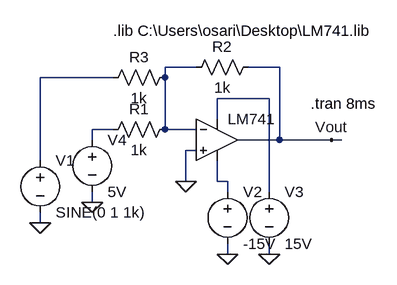
[diagram p0: schematic devre2.asc]
devre2.asc, the LTspice schematic file:
Version 4
SHEET 1 880 680
WIRE 96 96 48 96
WIRE 224 96 176 96
WIRE -32 112 -144 112
WIRE 48 112 48 96
WIRE 208 144 128 144
WIRE 128 176 128 144
WIRE -32 192 -64 192
WIRE 48 192 48 112
WIRE 96 192 48 192
WIRE -64 208 -64 192
WIRE 224 208 224 96
WIRE 224 208 160 208
WIRE 304 208 224 208
WIRE 320 208 304 208
WIRE 96 224 80 224
WIRE -144 240 -144 112
WIRE 80 272 80 224
WIRE 128 272 128 240
WIRE 144 272 128 272
WIRE 144 288 144 272
WIRE 208 288 208 144
WIRE -64 304 -64 288
WIRE -144 336 -144 320
WIRE 144 384 144 368
WIRE 208 384 208 368
FLAG 144 384 0
FLAG 208 384 0
FLAG 304 208 Vout
FLAG -144 336 0
FLAG -64 304 0
FLAG 80 272 0
SYMBOL voltage -144 224 R0
WINDOW 123 0 0 Left 0
WINDOW 39 0 0 Left 0
SYMATTR InstName V1
SYMATTR Value SINE(0 1 1k)
SYMBOL res 64 176 R90
WINDOW 0 0 56 VBottom 2
WINDOW 3 32 56 VTop 2
SYMATTR InstName R1
SYMATTR Value 1k
SYMBOL res 192 80 R90
WINDOW 0 0 56 VBottom 2
WINDOW 3 32 56 VTop 2
SYMATTR InstName R2
SYMATTR Value 1k
SYMBOL voltage 144 272 R0
WINDOW 123 0 0 Left 0
WINDOW 39 0 0 Left 0
SYMATTR InstName V2
SYMATTR Value -15V
SYMBOL voltage 208 272 R0
WINDOW 123 0 0 Left 0
WINDOW 39 0 0 Left 0
SYMATTR InstName V3
SYMATTR Value 15V
SYMBOL OpAmps\\UniversalOpamp2 128 208 R0
SYMATTR InstName LM741
SYMBOL res 64 96 R90
WINDOW 0 0 56 VBottom 2
WINDOW 3 32 56 VTop 2
SYMATTR InstName R3
SYMATTR Value 1k
SYMBOL voltage -64 192 R0
WINDOW 123 0 0 Left 0
WINDOW 39 0 0 Left 0
SYMATTR InstName V4
SYMATTR Value 5V
TEXT -32 40 Left 2 !.lib C:\\Users\\osari\\Desktop\\LM741.lib
TEXT 272 152 Left 2 !.tran 8ms

The netlist it stands for:
* devre2.asc
V1 N002 0 SINE(0 1 1k)
R1 N001 N004 1k
R2 Vout N001 1k
V2 N005 0 -15V
V3 N003 0 15V
XLM741 0 N001 N003 N005 Vout level.2 Avol=1Meg GBW=10Meg Slew=10Meg ilimit=25m rail=0 Vos=0 phimargin=45 en=0 enk=0 in=0 ink=0 Rin=500Meg  ; pins IN+ IN- V+ V- OUT
R3 N001 N002 1k
V4 N004 0 5V
.lib C:\Users\osari\Desktop\LM741.lib
.tran 8ms
.lib UniversalOpamps2.sub
.backanno
.end